# EAGLE schematic FT232-Breakout (EAGLE 6.6.0)
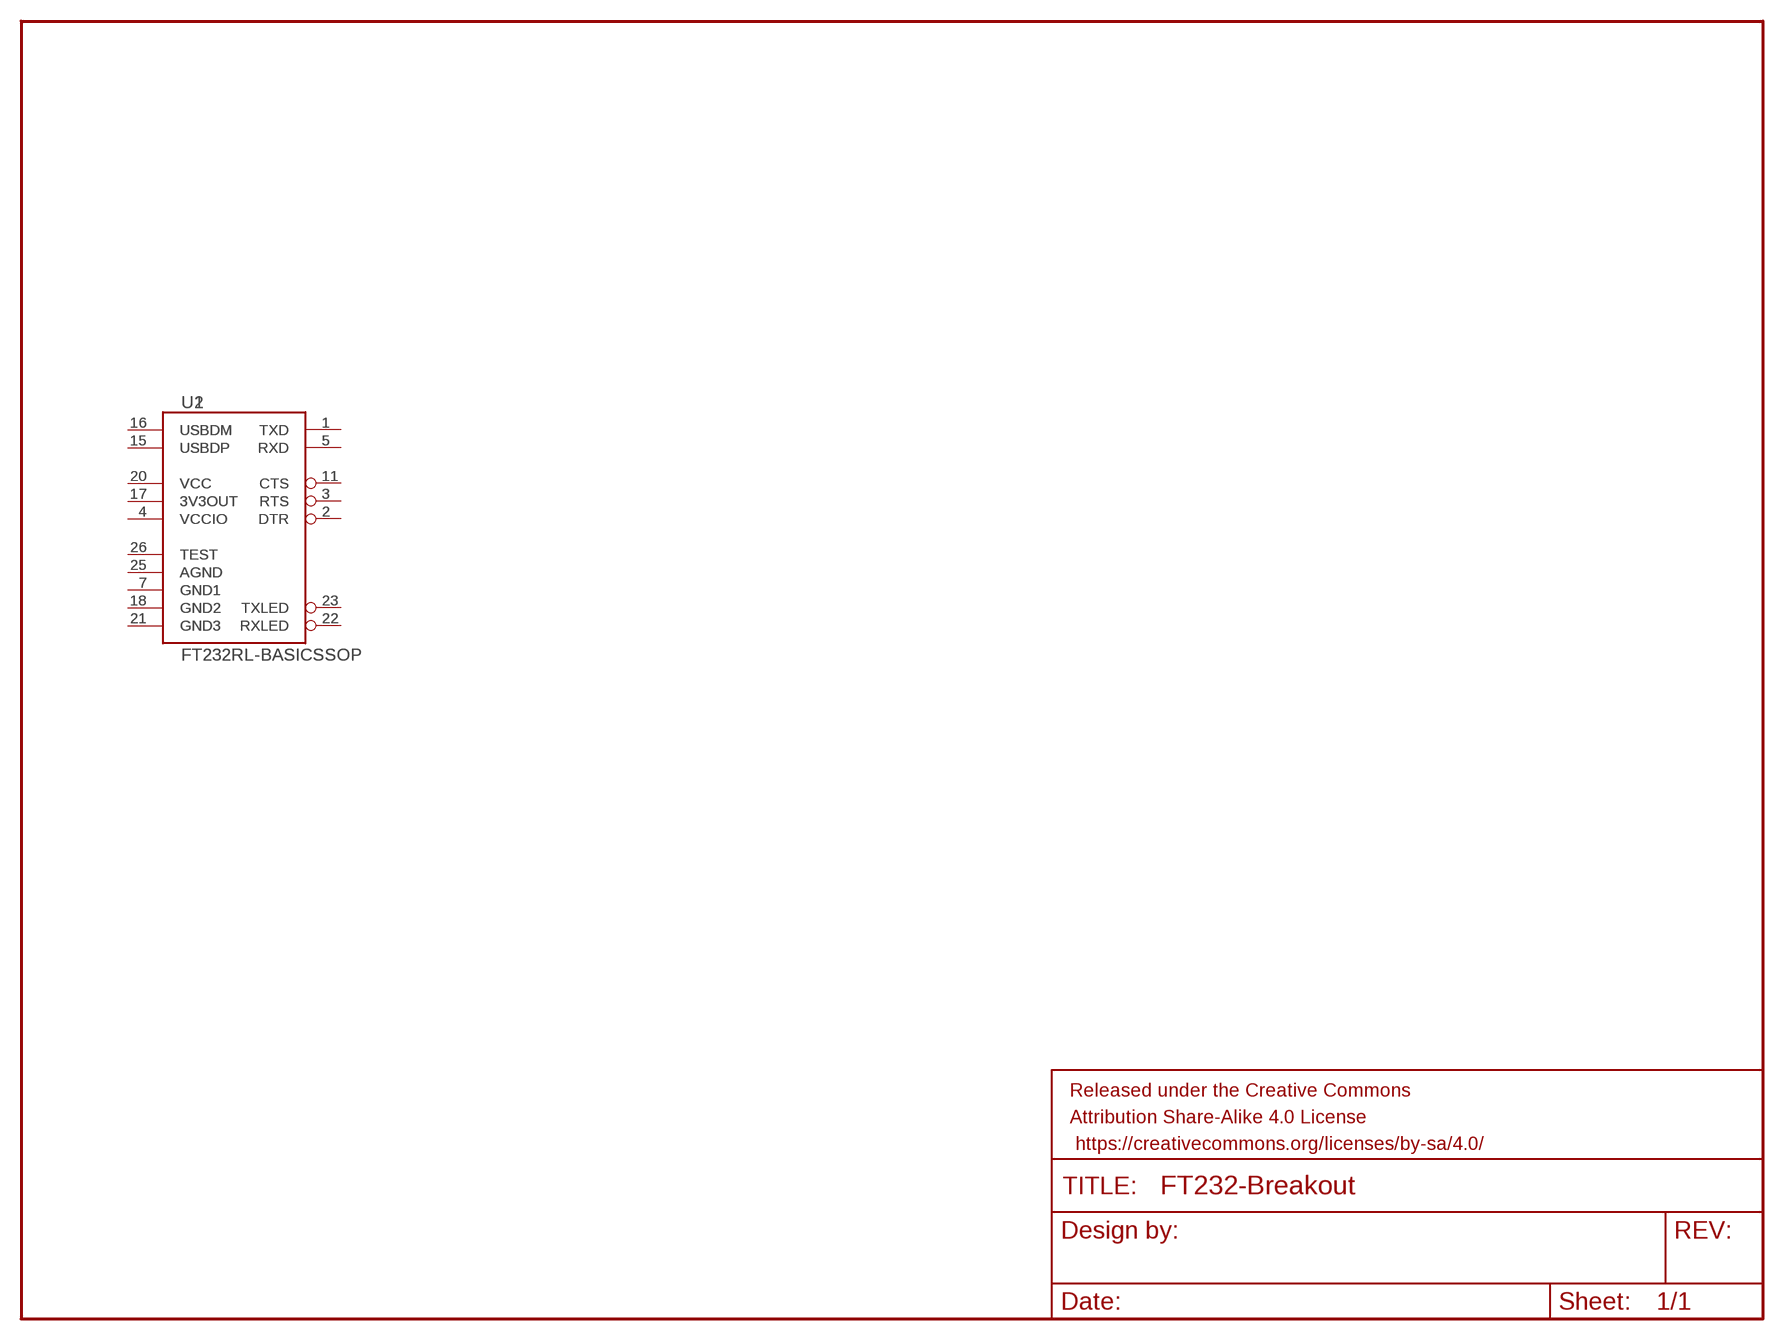
[diagram p0: schematic, sheet 1]

## Parts
FRAME1  FRAME-LETTER  [CREATIVE_COMMONS]
U1  FT232RL-BASICSSOP  [SSOP28DB]
U2  FT232RL-BASICSSOP  [SSOP28DB]

## Nets
N$1: U1.17(3V3OUT) U2.17(3V3OUT)
N$2: U1.16(USBDM) U2.16(USBDM)
N$3: U1.15(USBDP) U2.15(USBDP)
N$4: U1.7(GND1) U2.7(GND1)
N$5: U1.18(GND2) U2.18(GND2)
N$6: U1.21(GND3) U2.21(GND3)
N$7: U1.1(TXD) U2.1(TXD)
N$8: U1.5(RXD) U2.5(RXD)
N$9: U1.4(VCCIO) U2.4(VCCIO)
N$10: U1.25(AGND) U2.25(AGND)
N$11: U1.26(TEST) U2.26(TEST)
N$12: U1.20(VCC) U2.20(VCC)
N$13: U1.23(TXLED) U2.23(TXLED)
N$14: U1.22(RXLED) U2.22(RXLED)
N$15: U1.3(RTS) U2.3(RTS)
N$16: U1.11(CTS) U2.11(CTS)
N$17: U1.2(DTR) U2.2(DTR)

## Library data of the parts
FRAME1 = SparkFun-Aesthetics:FRAME-LETTER: Schematic Frame Standard 8.5x11 US Letter frame
U1 U2 = SparkFun-DigitalIC:FT232RL-BASIC: USB UART This is the simplified version of the FT232RL unit. Only what you need, nothing you don't. Spark Fun Electronics SKU : COM-00650